# EAGLE schematic expansion (EAGLE 9.6.2)
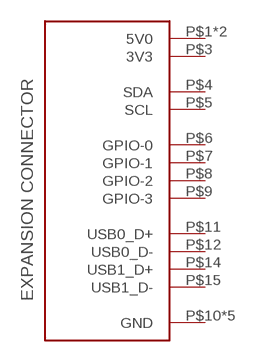
[diagram p0: schematic, sheet 1]

## Parts
U$1  EXPANSION-BOARD-CONNECTOR  [FPC-C528044]
Unconnected: U$1.P$1(5V0) U$1.P$2(5V0) U$1.P$3(3V3) U$1.P$4(SDA) U$1.P$5(SCL) U$1.P$6(GPIO-0) U$1.P$7(GPIO-1) U$1.P$8(GPIO-2) U$1.P$9(GPIO-3) U$1.P$10(GND) U$1.P$11(USB0_D+) U$1.P$12(USB0_D-) U$1.P$13(GND) U$1.P$14(USB1_D+) U$1.P$15(USB1_D-) U$1.P$16(GND) U$1.SHIELD1(GND) U$1.SHIELD2(GND)

## Library data of the parts
U$1 = pinebook_parts:EXPANSION-BOARD-CONNECTOR